# Altium schematic sheet Nano_Jtag.SchDoc
size A3
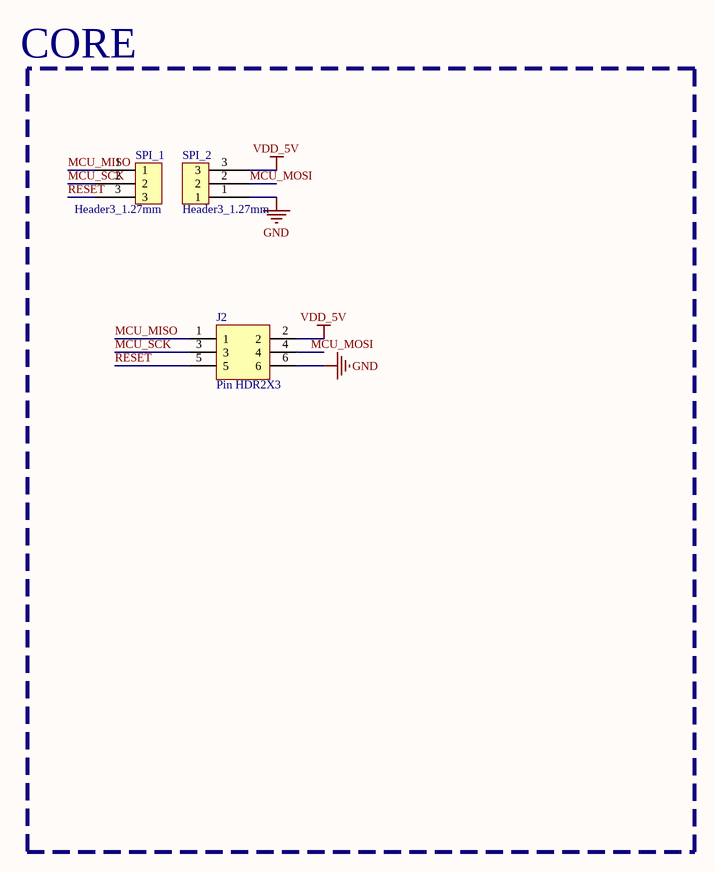
[diagram p0: Nano_Jtag.SchDoc]

## Parts
J2  Pin HDR2X3  [Pin HDR2X3/2.54mm-S]
SPI_1  Header3_1.27mm  [HEADER3_1.27mm]
SPI_2  Header3_1.27mm  [HEADER3_1.27mm]

## Nets
GND: J2.6 SPI_2.1
VDD_5V: J2.2 SPI_2.3
MCU_MISO: J2.1 SPI_1.1
MCU_MOSI: J2.4 SPI_2.2
MCU_SCK: J2.3 SPI_1.2
RESET: J2.5 SPI_1.3

## Notes on the sheet
- CORE